# Altium schematic sheet VL53 Schematic.SchDoc
size A4
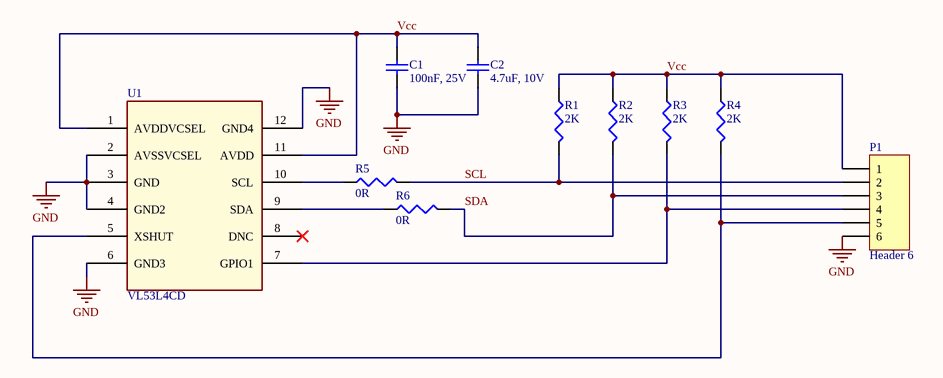
[diagram p0: VL53 Schematic.SchDoc]

## Parts
C1  100nF, 25V  [WCAP-CSGP_0603_H=0.8mm_Reflow]
C2  4.7uF, 10V  [WCAP-CSGP_0603_H=0.8mm_Reflow]
P1  Header 6  [HDR1X6]
R1  2K  [SM/R_0603]
R2  2K  [SM/R_0603]
R3  2K  [SM/R_0805]
R4  2K  [SM/R_0805]
R5  0R  [SM/R_0603]
R6  0R  [SM/R_0603]
U1  VL53L4CD  [VL53L4]

## Nets
GND: C1.1 C2.1 P1.6 U1.2(AVSSVCSEL) U1.3(GND) U1.4(GND2) U1.6(GND3) U1.12(GND4)
SCL: P1.2 R1.2 R5.2
SDA: P1.3 R2.2 R6.2
Vcc: C1.2 C2.2 P1.1 R1.1 R2.1 R3.1 R4.1 U1.1(AVDDVCSEL) U1.11(AVDD)
NetP1_4: P1.4 R3.2 U1.7(GPIO1)
NetP1_5: P1.5 R4.2 U1.5(XSHUT)
NetR5_1: R5.1 U1.10(SCL)
NetR6_1: R6.1 U1.9(SDA)

Not connected (* = marked no-connect by the designer): U1 8(DNC)*

## Library data of the parts
C1 = 885012206071: WCAP-CSGP Multilayer Ceramic Chip Capacitor, General Purpose, size 0603, X7R, 100nF, 25V; Manufacturer: Wurth Elektronik; Rated Voltage: 25VDC; Isolation Resistance: >=5GOhm; Capacitance Tolerance: +/-10%; Technical Reference: X7R0603104K025DFCT10000; ComponentLink1Description: Manufacturer; ComponentLink1URL: http://www.we-online.de; ComponentLink2Description: Datasheet; ComponentLink2URL: https://www.we-online.com/catalog/datasheet/885012206071.pdf; Operating Temperature: -55 to +125degC; Packaging: Tape and Reel; Manufacturer Part Number: 885012206071; Published Date: May 2020; Ceramic Type: X7R; Dissipation Factor: =<3.5%; Height: 0.8mm; Mounting Technology: SMT; Size: 0603; Capacitance: 100nF
C2 = 885012106012: WCAP-CSGP Multilayer Ceramic Chip Capacitor, General Purpose, size 0603, X5R, 4.7uF, 10V; Manufacturer: Wurth Elektronik; Rated Voltage: 10VDC; Isolation Resistance: >=0.02GOhm; Capacitance Tolerance: +/-20%; Technical Reference: X5R0603475M010DFCT10000; ComponentLink1Description: Manufacturer; ComponentLink1URL: http://www.we-online.de; ComponentLink2Description: Datasheet; ComponentLink2URL: https://www.we-online.com/catalog/datasheet/885012106012.pdf; Operating Temperature: -55 to +85degC; Packaging: Tape and Reel; Manufacturer Part Number: 885012106012; Published Date: May 2020; Ceramic Type: X5R; Dissipation Factor: =<10%; Height: 0.8mm; Mounting Technology: SMT; Size: 0603; Capacitance: 4.7uF
P1 = Header 6: Header, 6-Pin; LatestRevisionDate: 17-Jul-2002; LatestRevisionNote: Re-released for DXP Platform.; Publisher: Altium Limited
R1-R6 = SMRes: SMD Resistor; Mounting: SMD; RoHS: Yes; Category: Chip SMD Resistors; Stock 1: 1; Pricing 1: 10=0.67400, 100=0.52000, 250=0.49300, 500=0.33100, 1000=0.28900 (USD); Mount: Surface Mount; Number of Pins: 2; Resistor Type: FIXED RESISTOR